# Altium schematic sheet 06- NFC.SchDoc: NFC
size A4; DrawnBy: Trevor Charmley; DocumentNumber: 8; Revision: 1; SheetNumber: 8; SheetTotal: 8
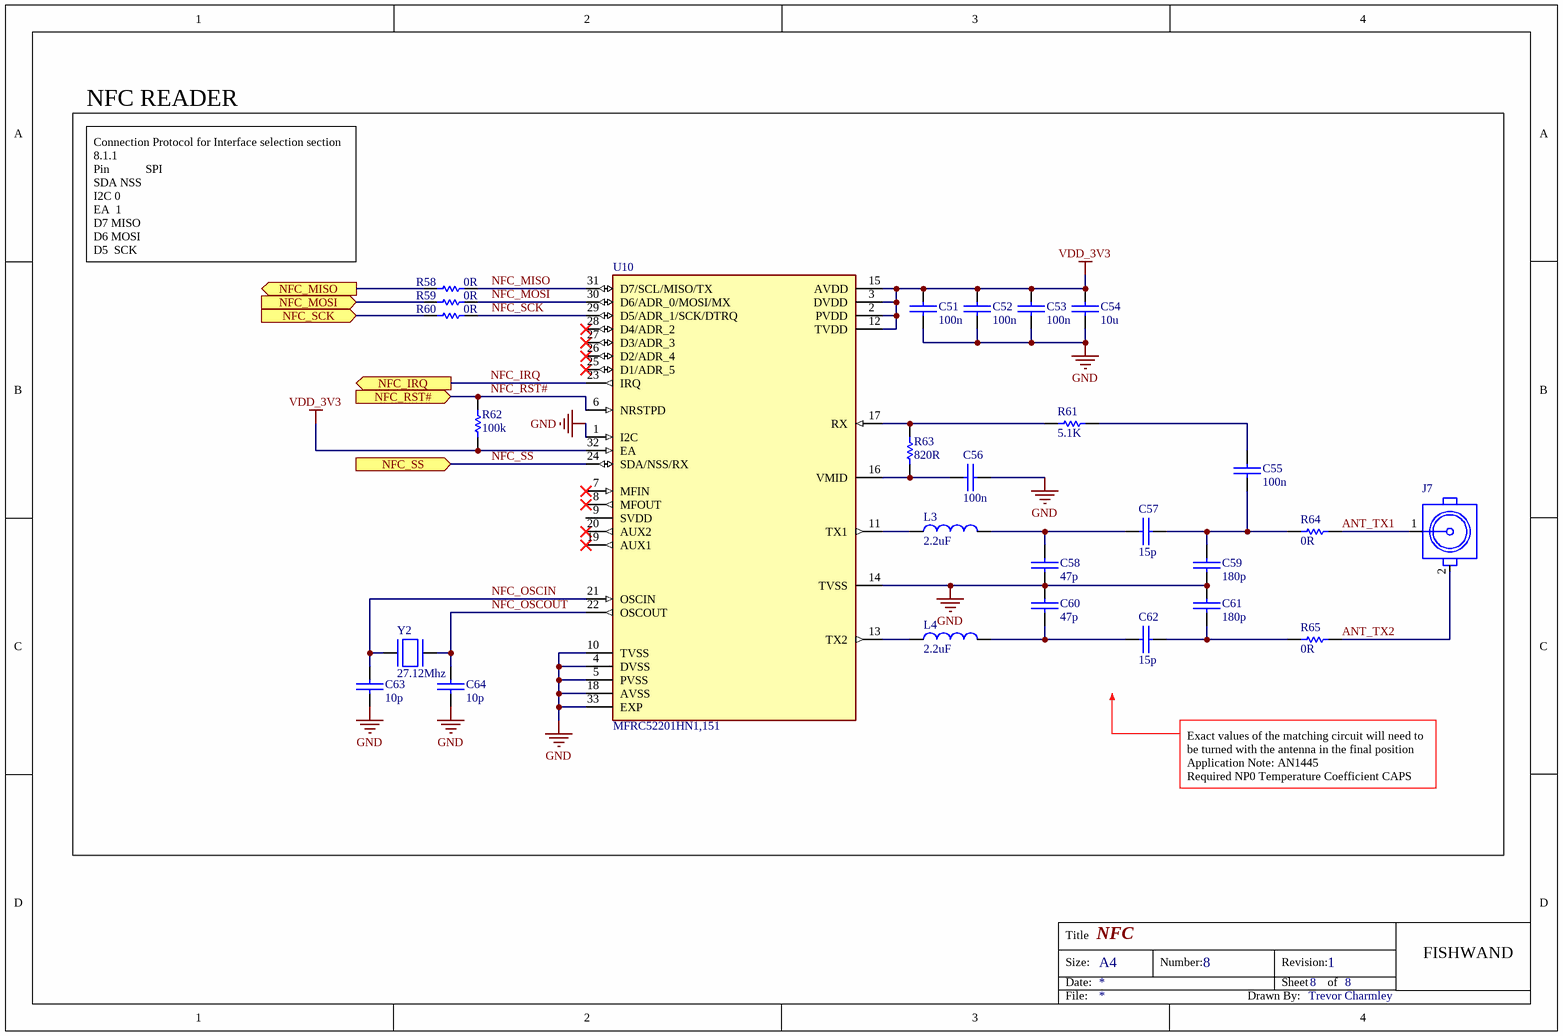
[diagram p0: 06- NFC.SchDoc]

## Parts
C51  100n  [CAPC100X50X65]
C52  100n  [CAPC100X50X65]
C53  100n  [CAPC100X50X65]
C54  10u  [CAPC100X50X65]
C55  100n  [CAPC100X50X65]
C56  100n  [CAPC100X50X65]
C57  15p  [CAPC100X50X65]
C58  47p  [CAPC100X50X65]
C59  180p  [CAPC100X50X65]
C60  47p  [CAPC100X50X65]
C61  180p  [CAPC100X50X65]
C62  15p  [CAPC100X50X65]
C63  10p  [CAPC100X50X65]
C64  10p  [CAPC100X50X65]
J7  RF20-01B-L-00-50-G-T/R  [MCX_SMT_RF20-01B-L-00-50-G-T/R]  (value not drawn)
L3  2.2uF  [INDC2016X180N]
L4  2.2uF  [INDC2016X180N]
R58  0R  [RESC0402]
R59  0R  [RESC0402]
R60  0R  [RESC0402]
R61  5.1K  [RESC0402]
R62  100k  [RESC0402]
R63  820R  [RESC0402]
R64  0R  [RESC0402]
R65  0R  [RESC0402]
U10  MFRC52201HN1,151  [QFN50P500X500X100-33N]
Y2  27.12Mhz  [OSC_XRCGB27M120F3M00R0]

## Blocks framed on the sheet
NFC READER: C51-C64 J7 L3 L4 R58-R65 U10 Y2

## Ports
NFC_IRQ (out), NFC_MISO (out), NFC_MOSI (in), NFC_RST# (in), NFC_SCK (in), NFC_SS (in)

## Nets
GND: C51.2 C52.2 C53.2 C54.2 C56.2 C58.2 C59.2 C60.1 C61.1 C63.2 C64.2 U10.1(I2C) U10.4(DVSS) U10.5(PVSS) U10.10(TVSS) U10.14(TVSS) U10.18(AVSS) U10.33(EXP)
VDD_3V3: C51.1 C52.1 C53.1 C54.1 R62.1 U10.2(PVDD) U10.3(DVDD) U10.12(TVDD) U10.15(AVDD) U10.32(EA)
ANT_TX1: J7.1 R64.2
ANT_TX2: J7.2 R65.2
NFC_IRQ: U10.23(IRQ) ; port NFC_IRQ
NFC_MISO: R58.2 U10.31(D7/SCL/MISO/TX)
NFC_MISO: R58.1 ; port NFC_MISO  [a separate net that carries the same name]
NFC_MOSI: R59.2 U10.30(D6/ADR_0/MOSI/MX)
NFC_MOSI: R59.1 ; port NFC_MOSI  [a separate net that carries the same name]
NFC_OSCIN: C63.1 U10.21(OSCIN) Y2.1
NFC_OSCOUT: C64.1 U10.22(OSCOUT) Y2.3
NFC_RST#: R62.2 U10.6(NRSTPD) ; port NFC_RST#
NFC_SCK: R60.2 U10.29(D5/ADR_1/SCK/DTRQ)
NFC_SCK: R60.1 ; port NFC_SCK  [a separate net that carries the same name]
NFC_SS: U10.24(SDA/NSS/RX) ; port NFC_SS
NetC55_1: C55.1 R61.2
NetC55_2: C55.2 C57.2 C59.1 R64.1
NetC56_1: C56.1 R63.1 U10.16(VMID)
NetC57_1: C57.1 C58.1 L3.2
NetC60_2: C60.2 C62.1 L4.2
NetC61_2: C61.2 C62.2 R65.1
NetL3_1: L3.1 U10.11(TX1)
NetL4_1: L4.1 U10.13(TX2)
NetR61_1: R61.1 R63.2 U10.17(RX)

Not connected (* = marked no-connect by the designer): U10 7(MFIN)* 8(MFOUT)* 9(SVDD) 19(AUX1)* 20(AUX2)* 25(D1/ADR_5)* 26(D2/ADR_4)* 27(D3/ADR_3)* 28(D4/ADR_2)*

## Notes on the sheet
- Connection Protocol for Interface selection section 8.1.1
  Pin            SPI
  SDA	NSS
  I2C	0
  EA 	1
  D7	MISO
  D6	MOSI
  D5 	SCK
- Exact values of the matching circuit will need to be turned with the antenna in the final position
  Application Note: AN1445
  Required NP0 Temperature Coefficient CAPS
- Title
- Size:
- Date:
- A4
- Number:
- Revision:
- Sheet
- of
- FISHWAND
- File:
- Drawn By:

## Library data of the parts
C51-C53 C55 C56 = C_100NF_25V_X5R_0402: CAP CER 100nF 25V X5R 0402; Manufacturer: Murata Electronics; Manufacturer PN: GRM155R61E104KA87D; Supplier: Digi-Key; Supplier PN: 490-5920-2-ND
C54 = C_10UF_10V_X5R_0402: CAP CER 10UF 10V X5R 0402; Manufacturer: Samsung Electro-Mechanics; Manufacturer PN: CL05A106MP5NUNC; Supplier PN: 1276-1450-1-ND
C57 C62 = C_15pF_0402_NP0_2%: 15 pF ±2% 50V Ceramic Capacitor C0G, NP0 0402 (1005 Metric); Manufacturer: YAGEO; Manufacturer PN: CC0402GRNPO9BN150; Value: 15pF; Supplier: Digi-Key; Supplier PN: 311-1649-1-ND; Tolerance: 2%
C58 C60 = C_47pF_0402_NP0_1%: 47 pF ±1% 50V Ceramic Capacitor C0G, NP0 0402 (1005 Metric); Manufacturer: YAGEO; Manufacturer PN: CC0402FRNPO9BN470; Value: 47pF; Supplier: Digi-Key; Supplier PN: 311-1646-1-ND; Tolerance: 1%
C59 C61 = C_180pF_0402_NP0_2%: 180 pF ±2% 50V Ceramic Capacitor C0G, NP0 0402 (1005 Metric); Manufacturer: YAGEO; Manufacturer PN: CC0402GRNPO9BN181; Value: 180pF; Supplier: Digi-Key; Supplier PN: 311-3333-1-ND; Tolerance: 2%
C63 C64 = C_10PF_50V_C0G/NP0_0402: CAP CER 10PF 50V C0G/NP0 0402; Manufacturer: Murata Electronics; Manufacturer PN: GRT1555C1H100JA02J; Supplier: Digi-Key; Supplier PN: 490-GRT1555C1H100JA02JTR-ND
J7 = CONN_RF_MCX_F20-01B-L-00-50-G-T/R: CONN RF MCX SMT VERT 50OHM; Manufacturer: Adam Tech; Manufacturer PN: RF20-01B-L-00-50-G-T/R; Supplier PN: 2057-RF20-01B-L-00-50-G-T/RCT-ND; Package / Case: MCX SMT VERT 50OHM; Supplier: Digi-Key
L3 L4 = L_LBM2016T2R2J_0805: 2.2 µH Unshielded Drum Core, Wirewound Inductor 340 mA 540mOhm 0806 (2016 Metric); Manufacturer: Taiyo Yuden; Value: *; SnapEDA_Link: https://www.snapeda.com/parts/LBM2016T2R2J/Taiyo%20Yuden/view-part/1510952/?ref=snap; Package / Case: 0805; Manufacturer PN: LBM2016T2R2J; Price: None; Availability: Unavailable; Supplier: Digi-Key; Supplier PN: 587-1807-1-ND
R58-R60 R64 R65 = R_0402_0R_5%: 0 Ohms Jumper 0.063W, 1/16W Chip Resistor 0402 (1005 Metric) Thick Film; Manufacturer: YAGEO; Manufacturer PN: RC0402JR-070RP; Tolerance: 5%; Supplier: *; Supplier PN: *; Value: 0R; Package / Case: 0402
R61 = R_0402_5.1K_1%: 5.1 kOhms ±1% 0.063W, 1/16W Chip Resistor 0402 (1005 Metric) Moisture Resistant Thick Film; Manufacturer: YAGEO; Manufacturer PN: RC0402FR-075K1L; Supplier: Digi-Key; Supplier PN: 311-5.10KLRTR-ND; Value: 5.1K; Tolerance: 1%; Package / Case: 0402
R62 = R_0402_100k_1%: 100 kOhms ±1% 0.063W, 1/16W Chip Resistor 0402 (1005 Metric) Moisture Resistant Thick Film; Manufacturer: YAGEO; Manufacturer PN: RC0402FR-07100KL; Supplier: Digi-Key; Supplier PN: 311-100KLRTR-ND; Value: 100k; Tolerance: 1%; Package / Case: 0402
R63 = R_0402_820R_1%: 820 Ohms ±1% 0.063W, 1/16W Chip Resistor 0402 (1005 Metric) Moisture Resistant Thick Film; Manufacturer: YAGEO; Manufacturer PN: RC0402FR-07820RL; Supplier: Digi-Key; Supplier PN: 311-820LRCT-ND; Value: 820R; Tolerance: 1%; Package / Case: 0402
U10 = MFRC52201HN1,151: RFID Reader IC 13.56MHz ISO 14443, MIFARE IÂ²C, SPI, UART 2.5V ~ 3.3V 32-VFQFN Exposed Pad; Manufacturer: NXP USA; Value: *; SnapEDA_Link: https://www.snapeda.com/parts/MFRC52201HN1%2C151/NXP%20USA%20Inc./view-part/480321/?ref=snap; Availability: Unavailable; Price: None; Package / Case: HVQFN-32; Manufacturer PN: MFRC52201HN1,151; Supplier: *
Y2 = Y_27.12Mhz_Crystal_XRCGB27M120F3M00R0: 27.12MHz Â±30ppm Crystal 6pF 150 Ohms 4-SMD, No Lead; Manufacturer: Murata Electronics; Value: *; SnapEDA_Link: https://www.snapeda.com/parts/XRCGB27M120F3M00R0/Murata%20Electronics%20North%20America/view-part/108821/?ref=snap; Manufacturer PN: XRCGB27M120F3M00R0; Purchase-URL: https://pricing.snapeda.com/search/part/XRCGB27M120F3M00R0/?ref=eda; Check_prices: https://www.snapeda.com/parts/XRCGB27M120F3M00R0/Murata%20Electronics%20North%20America/view-part/108821/?ref=eda; Availability: Good; Price: None; Supplier: Mouser; Supplier PN: 81-XRCGB27M120F3M0R0; Package / Case: SMD-4 Murata